# Altium project SensorBoardShield_Actuator_v2.0.PrjPcb
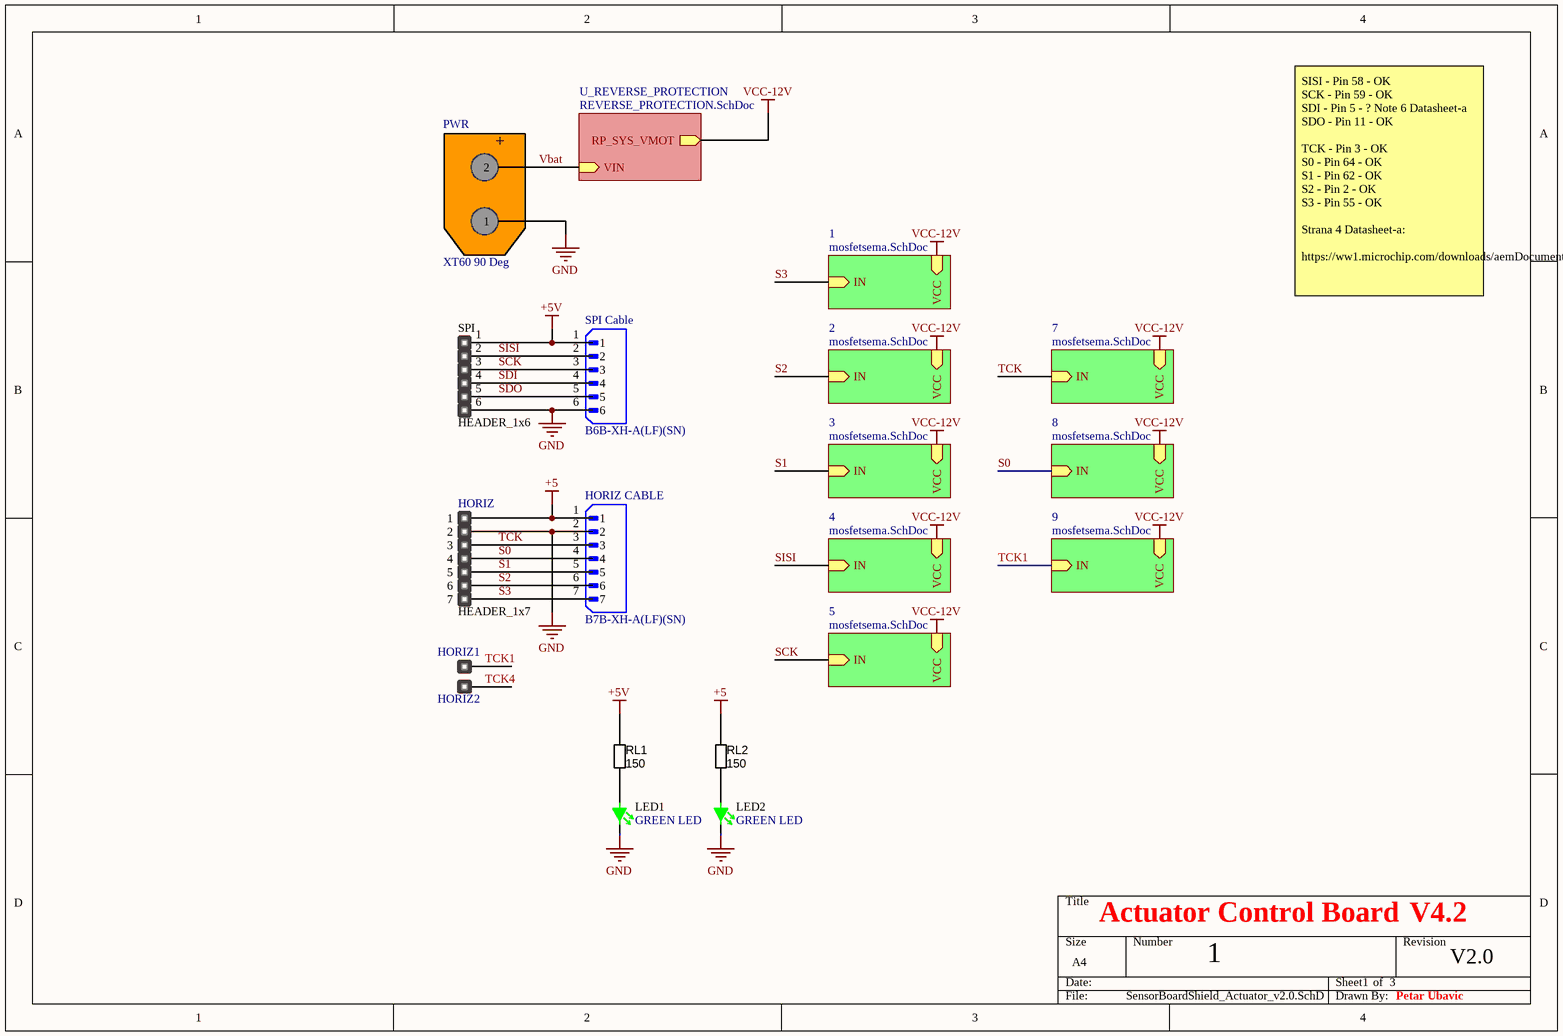
[diagram p0: SensorBoardShield_Actuator_v2.0.SchDoc]
3 sheets, 87 parts. Net scope: hierarchical (ports join the sheet entries above them; power ports are global).
Board file: SensorBoardShield_ActuatorV2.0.PcbDoc
Sheets:
  SensorBoardShield_Actuator_v2.0.SchDoc
    1 = mosfetsema.SchDoc
    3 = mosfetsema.SchDoc
    2 = mosfetsema.SchDoc
    4 = mosfetsema.SchDoc
    5 = mosfetsema.SchDoc
    7 = mosfetsema.SchDoc
    U_REVERSE_PROTECTION = REVERSE_PROTECTION.SchDoc
    8 = mosfetsema.SchDoc
    9 = mosfetsema.SchDoc

## Sheet SensorBoardShield_Actuator_v2.0.SchDoc
size A4; SheetNumber: 1; SheetTotal: 3

### Parts
HORIZ  HEADER_1x7  [HDR1X7]
HORIZ1  1 Pin Header  [1 Pin Header]  (value not drawn)
HORIZ2  1 Pin Header  [1 Pin Header]  (value not drawn)
HORIZ_CABLE  B7B-XH-A(LF)(SN)  [JST_B7B-XH-A(LF)(SN)]
LED1  GREEN LED  [DIOC1608X04N]
LED2  GREEN LED  [DIOC1608X04N]
PWR  XT60 90 Deg  [XT60PW-M]
RL1  150  [RES_0603]
RL2  150  [RES_0603]
SPI  HEADER_1x6  [HM1X6]
SPI_Cable  B6B-XH-A(LF)(SN)  [JST_B6B-XH-A(LF)(SN)]

### Sub-sheets
1 = mosfetsema.SchDoc: IN (in), VCC (in)
2 = mosfetsema.SchDoc: IN (in), VCC (in)
3 = mosfetsema.SchDoc: IN (in), VCC (in)
4 = mosfetsema.SchDoc: IN (in), VCC (in)
5 = mosfetsema.SchDoc: IN (in), VCC (in)
7 = mosfetsema.SchDoc: IN (in), VCC (in)
8 = mosfetsema.SchDoc: IN (in), VCC (in)
9 = mosfetsema.SchDoc: IN (in), VCC (in)
U_REVERSE_PROTECTION = REVERSE_PROTECTION.SchDoc: VIN (in), RP_SYS_VMOT (out)

### Nets
+5: HORIZ.1 HORIZ_CABLE.1 RL2.2
+5V: RL1.2 SPI.1 SPI_Cable.1
GND: HORIZ.2 HORIZ_CABLE.2 LED1.2 LED2.2 PWR.1 SPI.6 SPI_Cable.6
VCC-12V: sheet 1/VCC, sheet 3/VCC, sheet 2/VCC, sheet 4/VCC, sheet 5/VCC, sheet 7/VCC, sheet U_REVERSE_PROTECTION/RP_SYS_VMOT, sheet 8/VCC, sheet 9/VCC
S0: HORIZ.4 HORIZ_CABLE.4 ; sheet 8/IN
S1: HORIZ.5 HORIZ_CABLE.5 ; sheet 3/IN
S2: HORIZ.6 HORIZ_CABLE.6 ; sheet 2/IN
S3: HORIZ.7 HORIZ_CABLE.7 ; sheet 1/IN
SCK: SPI.3 SPI_Cable.3 ; sheet 5/IN
SDI: SPI.4 SPI_Cable.4
SDO: SPI.5 SPI_Cable.5
SISI: SPI.2 SPI_Cable.2 ; sheet 4/IN
TCK: HORIZ.3 HORIZ_CABLE.3 ; sheet 7/IN
TCK1: HORIZ1.1 ; sheet 9/IN
TCK4: HORIZ2.1
Vbat: PWR.2 ; sheet U_REVERSE_PROTECTION/VIN
NetLED1_1: LED1.1 RL1.1
NetLED2_1: LED2.1 RL2.1

### Notes on the sheet
- SISI - Pin 58 - OK
  SCK - Pin 59 - OK
  SDI - Pin 5 - ? Note 6 Datasheet-a
  SDO - Pin 11 - OK
  TCK - Pin 3 - OK
  S0 - Pin 64 - OK
  S1 - Pin 62 - OK
  S2 - Pin 2 - OK
  S3 - Pin 55 - OK
  Strana 4 Datasheet-a:
  https://ww1.microchip.com/downloads/aemDocuments/documents/MCU32/ProductDocuments/DataSheets/PIC32MK-GP-MC-Family-Data-Sheet-DS60001402H.pdf
- Actuator Control Board
- V4.2
- 1
- 3
- V2.0
- Petar Ubavic
- (in symbol XT60PW-M) +

### Library data of the parts
HORIZ = Header 7: Header, 7-Pin; LatestRevisionDate: 17-Jul-2002; LatestRevisionNote: Re-released for DXP Platform.; Publisher: Altium Limited
HORIZ1 HORIZ2 = 1 Pin Header: 1 Pin Header - Plated Through Hole TestPoint
HORIZ_CABLE = B7B-XH-A(LF)(SN): Connector Header Through Hole 7 position 0.098 (2.50mm); MF: JST Sales; SnapEDA_Link: https://www.snapeda.com/parts/B7B-XH-A%20(LF)(SN)/JST+Sales+America+Inc./view-part/?ref=snap; Package: None; Value: *; MP: B7B-XH-A (LF)(SN); Check_prices: https://www.snapeda.com/parts/B7B-XH-A%20(LF)(SN)/JST+Sales+America+Inc./view-part/?ref=eda
LED1 LED2 = 00000001: LED GREEN DIFFUSED 0603 SMD; Supplier 1: Avnet; Supplier Part Number 1: Q65111A3964; ComponentLink1Description: Digikey; ComponentLink1URL: https://www.digikey.com/en/products/detail/ams-osram-usa-inc/LG-Q396-PS-35/5249855
PWR = XT60PW-M
RL1 RL2 = R000004: RES 150 OHM 1% 1/10W 0603; resistance: 1Kohm; ComponentLink1Description: digikey; ComponentLink1URL: https://www.digikey.com/en/products/detail/vishay-beyschlag-draloric-bc-components/MCT06030C1001FP500/2607821
SPI_Cable = B6B-XH-A(LF)(SN): Connector Header Through Hole 6 position 0.098 (2.50mm); MF: JST Sales; SnapEDA_Link: https://www.snapeda.com/parts/B6B-XH-A(LF)(SN)/JST+Sales+America+Inc./view-part/?ref=snap; Package: None; Value: *; MP: B6B-XH-A(LF)(SN); Check_prices: https://www.snapeda.com/parts/B6B-XH-A(LF)(SN)/JST+Sales+America+Inc./view-part/?ref=eda

## Sheet mosfetsema.SchDoc
size A; SheetNumber: 2; SheetTotal: 3; SPICEModelCacheHYUHBJXB: <root> / <DocumentId>HYUHBJXB</DocumentId> / <CacheFrame Number="0"> / <Model Name="865080343009_100uf" Kind="CKT"> / <Text>******* / .subckt 865080343009_100uF 1 2 / Rser 1 3 0.9 / Lser 2 4 2.918567665E-09 / C1 3 4 0.0001 / Rpar 3 4 1000000 / .ends 865080343009_100uF</Text> / </Model> / </CacheFrame> / </root>
Used 8 times, as channels 1, 3, 2, 4, 5, 7, 8, 9. Parts and nets are listed once, with the designators drawn on the sheet.
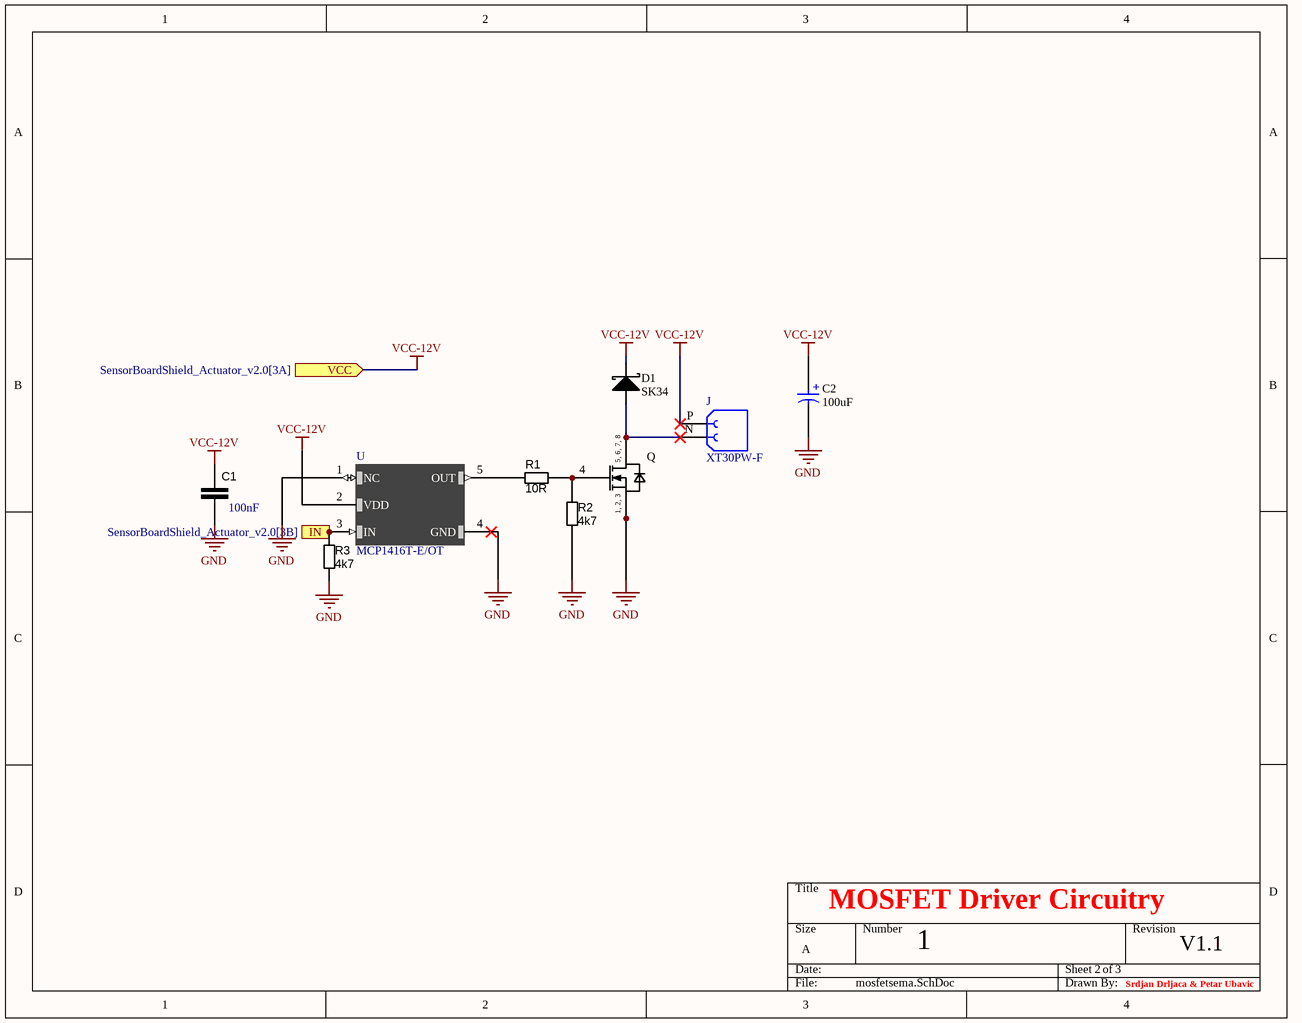
[diagram p1: mosfetsema.SchDoc]

### Parts
C1  100nF  [CAP_1206]
C2  100uF  [WCAP-ASLI_D6.3H5.5]
D1  SK34  [DO214AC]
J  XT30PW-F  [AMASS_XT30PW-F]
Q  IPZ40N04S5L-7R4  [INF-PG-TSDSON-8-32-1-V]  (value not drawn)
R1  10R  [RES_0603]
R2  4k7  [RES_0603]
R3  4k7  [RES_0603]
U  MCP1416T-E/OT  [SOT95P270X145-5N]

### Ports
IN (in, see SensorBoardShield_Actuator_v2.0[3B]), VCC (in, see SensorBoardShield_Actuator_v2.0[3A])

### Nets
GND: C1.1 C2.2(N) Q.1(SOURCE) Q.2(SOURCE) Q.3(SOURCE) R2.1 R3.1 U.1(NC) U.4(GND)
VCC-12V: C1.2 C2.1(P) D1.1(Cathode) J.P U.2(VDD) ; port VCC
IN: R3.2 U.3(IN) ; port IN
NetD1_2: D1.2(Anode) J.N Q.5(DRAIN) Q.6(DRAIN) Q.7(DRAIN) Q.8(DRAIN)
NetQ_4: Q.4(GATE) R1.2 R2.2
NetR1_1: R1.1 U.5(OUT)

### Channels
1: designators end in _1; ports IN=S3 VCC=VCC-12V
3: designators end in _3; ports IN=S1 VCC=VCC-12V
2: designators end in _2; ports IN=S2 VCC=VCC-12V
4: designators end in _4; ports IN=SISI VCC=VCC-12V
5: designators end in _5; ports IN=SCK VCC=VCC-12V
7: designators end in _7; ports IN=TCK VCC=VCC-12V
8: designators end in _8; ports IN=S0 VCC=VCC-12V
9: designators end in _9; ports IN=TCK1 VCC=VCC-12V

### Notes on the sheet
- MOSFET Driver Circuitry
- 1
- 2
- 3
- V1.1
- Srdjan Drljaca & Petar Ubavic
- (in symbol 865080343009) +
- (in symbol IPZ40N04S5L-7R4) 5, 6, 7, 8; 1, 2, 3

### Library data of the parts
C1 = C000017: CAP CER 100nF 50V X7R 1206; capacitance: 100nF; ComponentLink1Description: DigiKey
C2 = 865080343009: WCAP-ASLI Aluminum Electrolytic Capacitor, V-Chip, D6.3 x H5.5mm, 100uF, 16V; Manufacturer: Wurth Elektronik; Capacitance Tolerance: +/-20%; Dissipation Factor: 16%; Endurance: 2000h; Leakage Current: 16uA; Ripple Current: 255mA; Technical Reference: ASED055101M016DVCTBB000; Manufacturer Part Number: 865080343009; Category: Aluminum Electrolytic Capacitors; Match Code: WCAP-ASLI; ComponentLink1Description: Website Link; ComponentLink1URL: https://www.we-online.com/redexpert/article/865080343009?ad; ComponentLink2Description: Datasheet Link; ComponentLink2URL: https://www.we-online.com/redexpert/spec/865080343009?ad; Mount: Surface Mount; Operating Temperature Max: 105°C; Operating Temperature Min: -55°C; Packaging: Tape and Reel; Height: 5.5mm; Diameter: 6.3mm; Capacitance: 100uF; Rated Voltage (DC): 16V
D1 = SK34: DIODE SCHOTTKY 40V 3A DO214AC; Manufacturer: Vishay Semiconductor Diodes Division; Barcode: 0100000007488; id: 62; Assembly: SMD; Speed: Fast Recovery =< 500ns, > 200mA (Io); Voltage  Forward: 550mV @ 3A; item_id: 1025; Recommended Rating: Silver; Manufacturer Part Number: SK34; Category: Discrete Semiconductor Products; Datasheet URL: http://www.vishay.com/docs/88896/b330la.pdf; Package Case: DO-214AC, SMA; Family: DIODE; Voltage  DC Reverse: 40V; Current  Average Rectified: 3A; Diode Type: Schottky; Part Type: Discrete Semiconductors
J = XT30PW-F: MF: {'manufacturer': u'amass'}; Package: None; Price: None; Value: *; MP: XT30PW-F; Availability: Unavailable
Q = IPZ40N04S5L-7R4: Insulated-Gate Field-Effect Transistor (IGFET), N-Channel, Enhancement, Body Diode, Pin 1 Source, 2 Source, 3 Source, 4 Gate, 5 Drain, 6 Drain, 7 Drain, 8 Drain, 8 Pins; Manufacturer: Infineon Technologies; PackageReference: PG-TSDSON-8-32; ManufacturerPartNumber: IPZ40N04S5L-7R4
R1 = R000004: RES 10 OHM 1% 1/10W 0603; resistance: 1Kohm; ComponentLink1Description: digikey; ComponentLink1URL: https://www.digikey.com/en/products/detail/vishay-beyschlag-draloric-bc-components/MCT06030C1001FP500/2607821
R2 R3 = R000004: RES 4k7 OHM 1% 1/10W 0603; resistance: 1Kohm; ComponentLink1Description: digikey; ComponentLink1URL: https://www.digikey.com/en/products/detail/vishay-beyschlag-draloric-bc-components/MCT06030C1001FP500/2607821
U = MCP1416T-E/OT: Low-Side Gate Driver IC Non-Inverting SOT-23-5; MF: Microchip; Price: None; Availability: Good; SnapEDA_Link: https://www.snapeda.com/parts/MCP1416T-E/OT/Microchip/view-part/287469/?ref=snap; Package: SOT-23-5 Microchip; MP: MCP1416T-E/OT; Value: *; Purchase-URL: https://pricing.snapeda.com/search/part/MCP1416T-E/OT/?ref=eda; Check_prices: https://www.snapeda.com/parts/MCP1416T-E/OT/Microchip/view-part/287469/?ref=eda

## Sheet REVERSE_PROTECTION.SchDoc
size A4; SheetNumber: 3; SheetTotal: 3
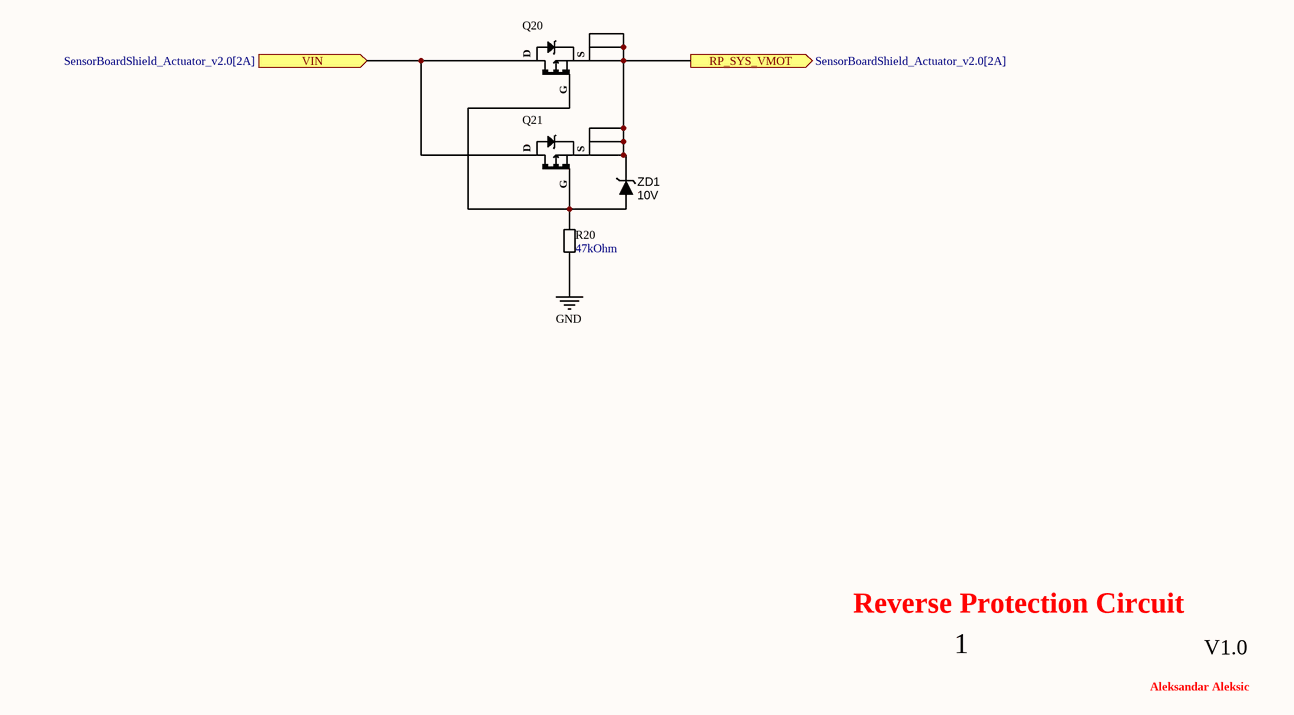
[diagram p2: REVERSE_PROTECTION.SchDoc]

### Parts
Q20  SQJ659EP PMOS  [PowerPAK SO-8L SINGLE]  (value not drawn)
Q21  SQJ659EP PMOS  [PowerPAK SO-8L SINGLE]  (value not drawn)
R20  47kOhm  [RES_0603]
ZD1  10V  [DIO_SMA]

### Ports
RP_SYS_VMOT (out, see SensorBoardShield_Actuator_v2.0[2A]), VIN (in, see SensorBoardShield_Actuator_v2.0[2A])

### Nets
GND: R20.1
VCC-12V: Q20.S(S1) Q21.S(S1) ZD1.1(Cathode) ; port RP_SYS_VMOT
Vbat: Q20.D Q21.D ; port VIN
NetQ20_G: Q20.G Q21.G R20.2 ZD1.2(Anode)

### Notes on the sheet
- Reverse Protection Circuit
- 1
- V1.0
- Aleksandar Aleksic

### Library data of the parts
Q20 Q21 = 00000005: P-Channel 60 V 52A (Tc) 83W (Tc) Surface Mount PowerPAK® SO-8; DigiKey Part Number: SQJ459EP-T1_GE3CT-ND; Mouser Part Number: 78-SQJ459EP-T2_BE3; ComponentLink1Description: DigiKey; ComponentLink1URL: https://www.digikey.com/en/products/detail/vishay-siliconix/SQJ459EP-T1-GE3/6708881; ComponentLink2Description: Mouser; ComponentLink2URL: https://eu.mouser.com/ProductDetail/Vishay-Siliconix/SQJ459EP-T2_BE3?qs=CiayqK2gdcKpg8h0vLRPjA%3D%3D
R20 = R000010: 47 kOhms ±1% 0.1W, 1/10W Chip Resistor 0603 (1608 Metric) Moisture Resistant Thick Film; ComponentLink1Description: DigiKey; ComponentLink1URL: https://www.digikey.com/en/products/detail/yageo/RC0603FR-0747KL/727253; resistance: 47kOhm; DigiKey Part Number: 311-47.0KHRCT-ND
ZD1 = 1SMA5931-AU_R1: Zener Diode 10 V 5 W ±5% Surface Mount SMC (DO-214AB); Value: 10V; ComponentLink1Description: digikey; ComponentLink1URL: https://www.digikey.com/en/products/detail/panjit-international-inc/1SMC5347-AU-R1-000A1/15799564

## Nets that join several sheets
GND: SensorBoardShield_Actuator_v2.0 (7 pins), 1 (9 pins), 3 (9 pins), 2 (9 pins), 4 (9 pins), 5 (9 pins), 7 (9 pins), REVERSE_PROTECTION (R20.1), 8 (9 pins), 9 (9 pins)
VCC-12V: 1 (5 pins), 3 (5 pins), 2 (5 pins), 4 (5 pins), 5 (5 pins), 7 (5 pins), REVERSE_PROTECTION (Q20.S Q21.S ZD1.1), 8 (5 pins), 9 (5 pins)
S0: SensorBoardShield_Actuator_v2.0 (HORIZ.4 HORIZ_CABLE.4), 8 (R3_8.2 U_8.3)
S1: SensorBoardShield_Actuator_v2.0 (HORIZ.5 HORIZ_CABLE.5), 3 (R3_3.2 U_3.3)
S2: SensorBoardShield_Actuator_v2.0 (HORIZ.6 HORIZ_CABLE.6), 2 (R3_2.2 U_2.3)
S3: SensorBoardShield_Actuator_v2.0 (HORIZ.7 HORIZ_CABLE.7), 1 (R3_1.2 U_1.3)
SCK: SensorBoardShield_Actuator_v2.0 (SPI.3 SPI_Cable.3), 5 (R3_5.2 U_5.3)
SISI: SensorBoardShield_Actuator_v2.0 (SPI.2 SPI_Cable.2), 4 (R3_4.2 U_4.3)
TCK: SensorBoardShield_Actuator_v2.0 (HORIZ.3 HORIZ_CABLE.3), 7 (R3_7.2 U_7.3)
TCK1: SensorBoardShield_Actuator_v2.0 (HORIZ1.1), 9 (R3_9.2 U_9.3)
Vbat: SensorBoardShield_Actuator_v2.0 (PWR.2), REVERSE_PROTECTION (Q20.D Q21.D)